# Altium schematic sheet 02-IC.SchDoc
size A
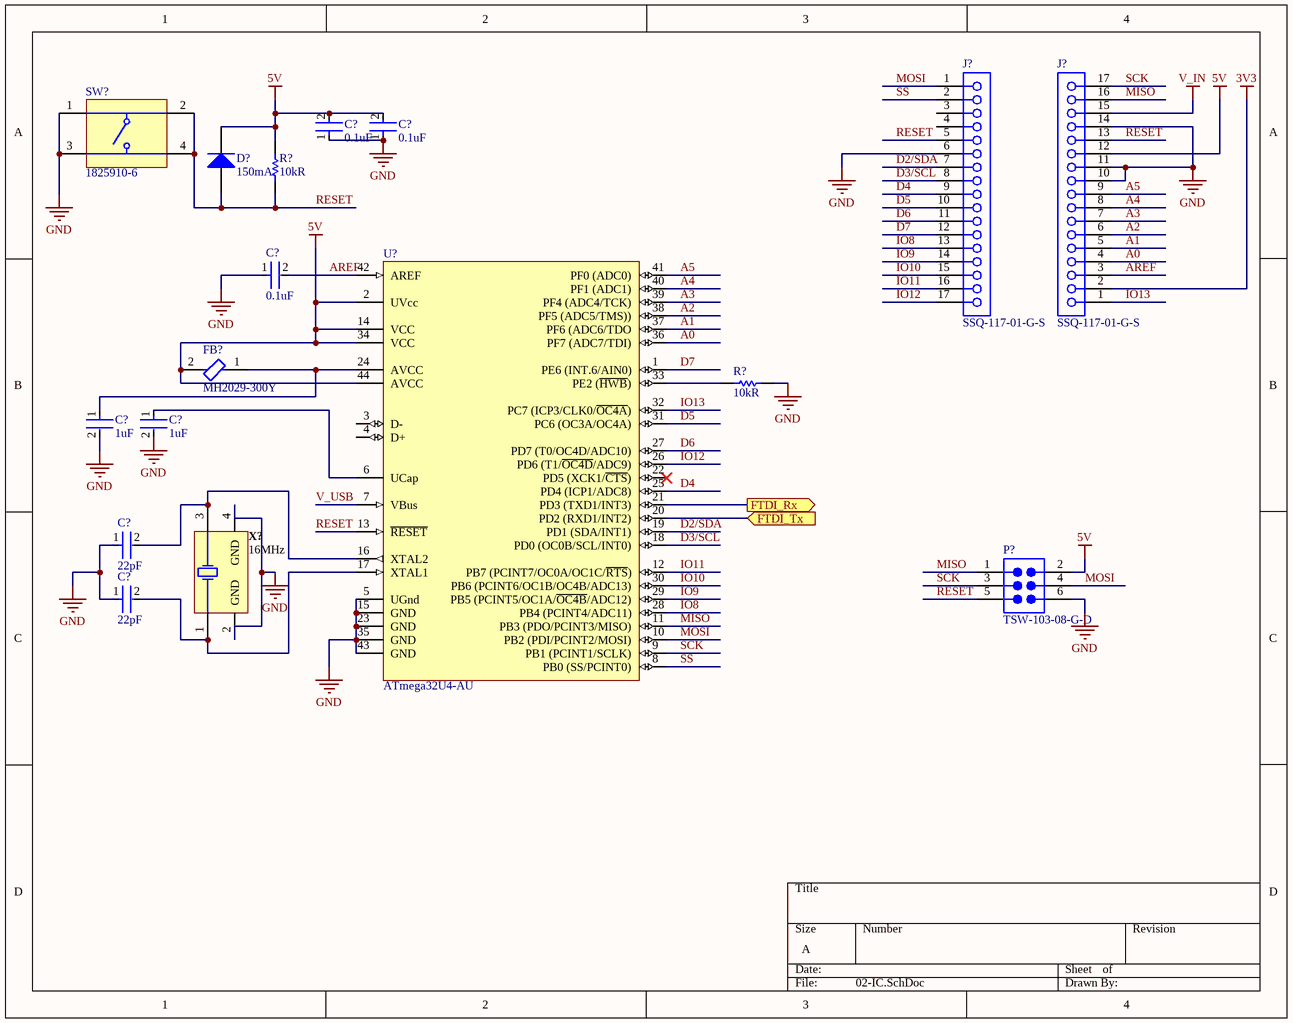
[diagram p0: 02-IC.SchDoc]

## Parts
(Parts that share a designator on the sheet are numbered #1, #2 ... from top to bottom, then left to right.)
C?#1  0.1uF  [FP-C1206C-EB-MFG]
C?#2  0.1uF  [FP-C1206C-EB-MFG]
C?#3  0.1uF  [FP-C1206C-EB-MFG]
C?#4  1uF  [FP-GRM15-0_1-MFG]
C?#5  1uF  [FP-GRM15-0_1-MFG]
C?#6  22pF  [FP-C0805C-DN-MFG]
C?#7  22pF  [FP-C0805C-DN-MFG]
D?  150mA  [BOUR-CD1206-S01575-2_L]
FB?  MH2029-300Y  [FP-MH2029-MFG]
J?#1  SSQ-117-01-G-S  [SMTC-SSQ-117-01-X-S]
J?#2  SSQ-117-01-G-S  [SMTC-SSQ-117-01-X-S]
P?  TSW-103-08-G-D  [SMTC-TSW-103-08-X-D]
R?#1  10kR  [RESC1609X50X30ML10T20]
R?#2  10kR  [RESC1609X50X30ML10T20]
SW?  1825910-6  [TECO-1825910-6_V]
U?  ATmega32U4-AU  [44ML_M]
X?  16MHz  [ABRA-ABM3B-4_V]

## Ports
FTDI_Rx (out), FTDI_Tx (in)

## Nets
3V3: J?#2.2
5V: C?#1.2 C?#2.2 D?.2(K) FB?.2 J?#2.12 P?.2 R?#1.2 U?.2(UVcc) U?.14(VCC) U?.34(VCC) U?.44(AVCC)
GND: C?#1.1 C?#2.1 C?#3.1 C?#4.2 C?#5.2 C?#6.1 C?#7.1 J?#1.6 J?#2.10 J?#2.11 J?#2.14 P?.6 R?#2.1 SW?.1 SW?.3 U?.5(UGnd) U?.15(GND) U?.23(GND) U?.35(GND) U?.43(GND) X?.2(GND) X?.4(GND)
V_IN: J?#2.15
A0: J?#2.4 U?.36(PF7_(ADC7/TDI))
A1: J?#2.5 U?.37(PF6_(ADC6/TDO)
A2: J?#2.6 U?.38(PF5_(ADC5/TMS)))
A3: J?#2.7 U?.39(PF4_(ADC4/TCK))
A4: J?#2.8 U?.40(PF1_(ADC1))
A5: J?#2.9 U?.41(PF0_(ADC0))
AREF: C?#3.2 J?#2.3 U?.42(AREF)
D2/SDA: J?#1.7 U?.19(PD1_(SDA/INT1))
D3/SCL: J?#1.8 U?.18(PD0_(OC0B/SCL/INT0))
D4: J?#1.9 U?.25(PD4_(ICP1/ADC8))
D5: J?#1.10 U?.31(PC6_(OC3A/OC4A))
D6: J?#1.11 U?.27(PD7_(T0/OC4D/ADC10))
D7: J?#1.12 U?.1(PE6_(INT.6/AIN0))
FTDI_Rx: U?.21(PD3_(TXD1/INT3)) ; port FTDI_Rx
FTDI_Tx: U?.20(PD2_(RXD1/INT2)) ; port FTDI_Tx
IO8: J?#1.13 U?.28(PB4_(PCINT4/ADC11))
IO9: J?#1.14 U?.29(PB5_(PCINT5/OC1A/~{OC4B}/ADC12))
IO10: J?#1.15 U?.30(PB6_(PCINT6/OC1B/OC4B/ADC13))
IO11: J?#1.16 U?.12(PB7_(PCINT7/OC0A/OC1C/~{RTS}))
IO12: J?#1.17 U?.26(PD6_(T1/~{OC4D}/ADC9))
IO13: J?#2.1 U?.32(PC7_(ICP3/CLK0/~{OC4A}))
MISO: J?#2.16 P?.1 U?.11(PB3_(PDO/PCINT3/MISO))
MOSI: J?#1.1 P?.4 U?.10(PB2_(PDI/PCINT2/MOSI))
RESET: D?.1(A) J?#1.5 J?#2.13 P?.5 R?#1.1 SW?.2 SW?.4 U?.13(~{RESET})
SCK: J?#2.17 P?.3 U?.9(PB1_(PCINT1/SCLK))
SS: J?#1.2 U?.8(PB0_(SS/PCINT0))
V_USB: U?.7(VBus)
NetC?#4_1: C?#4.1 FB?.1 U?.24(AVCC)
NetC?#5_1: C?#5.1 U?.6(UCap)
NetC?#6_2: C?#6.2 U?.16(XTAL2) X?.3(X2)
NetC?#7_2: C?#7.2 U?.17(XTAL1) X?.1(X1)
NetR?#2_2: R?#2.2 U?.33(PE2_(~{HWB}))

Not connected (* = marked no-connect by the designer): J?#1 3 4; U? 3(D-) 4(D+) 22(PD5_(XCK1/~{CTS}))*

## Library data of the parts
C?#1-C?#3 = CMP-03020-000153-1: CAP CER 0.1UF 100V X7R 1206; Manufacturer: KEMET; Manufacturer Part Number: C1206C104K1RACTU; Value: 0.10 μF; Tolerance: 0.1; Material: Ceramic; Temperature Coefficient: 15%; Automotive Grade: Grade 0; Voltage Rating: 100 V; Automotive: Yes; Ipc Land Pattern Name: CAPC320160X78; Device Class L1: Passive Components; ComponentLink2Description: Datasheet; Temperature Range Low: -55°C; Category: Cap; Octopart: https://octopart.com/c1206c104k1ractu-kemet-89521; Height: 0.88mm; Lead Free: Yes; Digikey Description: CAP CER 0.1UF 100V X7R 1206; Mouser Description: CAP CER 0.1UF 100V X7R 1206; Device Class L3: Ceramic Capacitors; Device Class L2: Capacitors; ComponentLink2URL: https://content.kemet.com/datasheets/KEM_C1007_X8R_ULTRA_150C_SMD.pdf; Temperature Range High: +150°C; Temperature Characteristic: X7R; RoHS: TRUE; Capacitance: 0.10 μF; Package: C1206C-EB; Temperature: -55°C to +150°C
C?#4 C?#5 = CMP-06035-000073-1: CAP CER 1UF 10V X5R 0402; Manufacturer Part Number: GRM155R61A105KE15D; Manufacturer: Murata; Material: Ceramic; Tolerance: 10%; Temperature Coefficient: 15%; Description: 1µF ±10% 10V Ceramic Capacitor X5R 0402 (1005 Metric); Octopart: https://octopart.com/grm155r61a105ke15d-murata-197442; Lead Free: Yes; ComponentLink2Description: Datasheet; Temperature: -55°C to +85°C; Temperature Range High: +85°C; Height: 0.55mm; Capacitance: 1uF; Ipc Land Pattern Name: CAPC10050X50; ComponentLink2URL: https://search.murata.co.jp/Ceramy/image/img/A01X/G101/ENG/GRM155R61A105KE15-01A.pdf; Temperature Range Low: -55°C; Device Class L2: Capacitors; Voltage Rating: 10V; RoHS: TRUE; Device Class L1: Passive Components; Device Class L3: Ceramic Capacitors; Temperature Characteristic: X5R; Mouser Description: 0402 1 uF 10 V ±10% Tolerance X5R Surface Mount Multilayer Ceramic Capacitor; Automotive: No; Package: GRM15-0.1; Digikey Description: CAP CER 1UF 10V X5R 0402; Value: 1uF; Category: Cap
C?#6 C?#7 = CMP-03020-014268-1: Capacitor; Ceramic; Cap; 22.0pF; Tol 5%; SMT; Vol-Rtg 50V; C0G; Tape and Reel; Manufacturer: KEMET; Manufacturer Part Number: C0805C220J5GACTU; Temperature Coefficient: 30ppm/°C; Description: C0805 22 pF C0G 30ppm/°C 5.00% 50 V; Tolerance: 0.05; Device Class L1: Passive Components; Mouser Description: Multilayer Ceramic Capacitors MLCC - SMD/SMT 50volts 22pF C0G 5%; Temperature Range Low: -55°C; Automotive: No; Voltage Rating: 50 V; Material: Ceramic; Category: Cap; Height: 0.88mm; Temperature Range High: +125°C; Capacitance: 22 pF; Digikey Description: Capacitor; Ceramic; Cap; 22.0pF; Tol 5%; SMT; Vol-Rtg 50V; C0G; Tape and Reel; Octopart: https://octopart.com/c0805c220j5gactu-kemet-145470; ComponentLink2Description: Datasheet; Device Class L2: Capacitors; Ipc Land Pattern Name: CAPC200125X78; Value: 22 pF; RoHS: TRUE; ComponentLink2URL: https://content.kemet.com/datasheets/KEM_C1003_C0G_SMD.pdf; Temperature: -55°C to +125°C; Device Class L3: Ceramic Capacitors; Lead Free: Yes; Temperature Characteristic: C0G; Package: C0805C-DN
D? = CMP-0583-00001-2: 75 V Small Signal Switching Diode, 150 mA, 2.5 uA, 1026 Molded Package, RoHS, Tape and Reel; Manufacturer: Bourns; PartNumber: CD1206-S01575; Reverse Voltage: 75 V; Reverse Current (Max.): 2.5 uA; Capacitance Between Terminals (Max.): 3 pF; Reverse Recovery Time (Max.): 4 nS; Forward Voltage (Max.): 1.00 V; Packing: Tape and Reel; Mounting Technology: Surface Mount; DatasheetVersion: Rev. 06/11; ComponentLink2URL: http://www.bourns.com/data/global/pdfs/CD1206_S01575.pdf; Average Forward Current: 150 mA; PackageReference: CD1206-S01575-2; RoHS: TRUE; ComponentLink1URL: http://www.bourns.com/; ComponentLink1Description: Manufacturer URL; ComponentLink3Description: Package Specification; ComponentLink3URL: http://www.bourns.com/data/global/pdfs/CD1206_S01575.pdf; ComponentLink2Description: Datasheet; PackageDescription: 2-Pin SMD, Body 3.2 x 1.5 mm
FB? = CMP-07252-000001-1: FERRITE BEAD 30 OHM 0805 1LN; Manufacturer: Bourns; Series Resistance: 25mΩ; Description: MH Series High Current Chip Ferrite Beads; Resistance: 30Ω; Value: 30Ω; Impedance At Frequency: 30Ω @ 100MHz; Rms Current: 3A; Tolerance: 25%; RoHS: TRUE; Manufacturer Part Number: MH2029-300Y; Temperature Range High: +125°C; Device Class L3: Ferrite Beads and Chips; Core Material: Ferrite; ComponentLink2Description: Datasheet; Category: FBead; Octopart: https://octopart.com/mh2029-300y-bourns-756929; Digikey Description: FERRITE BEAD 30 OHM 0805 1LN; Device Class L2: EMI / RFI Components; Lead Free: Yes; Mouser Description: Ferrite Beads 30 ohms 25% HIGH CURRENT; Automotive: No; Ipc Land Pattern Name: CAPC200120X90; Temperature: -55°C to +125°C; Device Class L1: Passive Components; Height: 1.1mm; ComponentLink2URL: https://www.bourns.com/docs/Product-Datasheets/mh.pdf; Package: MH2029; Temperature Range Low: -55°C
J?#1 J?#2 = CMP-1023-00316-1: SQ Post Socket, Through-hole, Vertical, -55 to 125 degC, 2.54 mm Pitch, 17-Pin, Female, RoHS; Manufacturer: Samtec; Pitch: 2.54 mm; ComponentLink1Description: Manufacturer URL; RoHS: True; PackageDescription: Assembly, Socket Strip .025[0.64] SQ Tail; ComponentLink1URL: http://www.samtec.com; DatasheetVersion: F-214; ComponentLink3URL: http://www.samtec.com/documents/webfiles/cpdf/SSQ-1XX-XX-XXX-X-XX-XXX-XX-X-MKT.pdf; Orientation: Vertical; PartNumber: SSQ-117-01-G-S; ComponentLink2URL: http://www.samtec.com/documents/webfiles/pdf/SSQ_TH.PDF; PackageReference: SSQ-117-01-X-S; ComponentLink2Description: Datasheet; Temperature Range: -55 to 125 degC; ComponentLink3Description: Package Specification; PackageVersion: BD, 6/1987; Mounting Technology: Through-hole
P? = CMP-1024-00338-1: 0.025" SQ Post Header, Through-hole, Vertical, -55 to 125 degC, 2.54 mm Pitch, 6-Pin, Male, RoHS; Manufacturer: Samtec; Pitch: 2.54 mm; ComponentLink1URL: http://www.samtec.com; ComponentLink2URL: http://www.samtec.com/documents/webfiles/pdf/TSW_TH.PDF; Temperature Range: -55 to 125 degC; RoHS: True; ComponentLink2Description: Datasheet; PackageReference: TSW-103-08-X-D; ComponentLink3Description: Package Specification; PackageDescription: .025[0.64] SQ. Post Terminal Strip Assembly; DatasheetVersion: F-214; Mounting Technology: Through-hole; ComponentLink1Description: Manufacturer URL; Orientation: Vertical; PartNumber: TSW-103-08-G-D; PackageVersion: DM, 8/1988; ComponentLink3URL: http://www.samtec.com/documents/webfiles/cpdf/TSW-XXX-XX-XXX-X-XX-XXX-MKT.pdf
R?#1 R?#2 = CMP-2000-03838-1: Manufacturer: Vishay Dale; Part Number: CRCW060310K0JNEA
SW? = CMP-1684-00021-1: Tact Switch, SPST-NO, 0.05 A, -35 to 85 degC, 4-Pin THD, RoHS, Bulk; Manufacturer: TE Connectivity; Maximum Contact Resistance: 100mOhm; Mechanical Life: 100000Cycles; Bushing Type: Unthreaded; Switch Configuration: OFF(ON); Maximum DC Voltage Rating: 24V; Contact Rating @ Voltage: 0.05A@24VDC; Actuator Color: Black; Body Orientation: Straight; Function: MomentaryContact; Illumination: N/R; Actuator Style: RoundButton; Actuator Material: PolybutyleneTerephthalate; Dielectric Strength: 500VAC; Pole Throw Configuration: SPST; Actuator Length: 1.4mm; Product Weight: N/A; Contact Material: CopperAlloy; Housing Material: N/A; Terminal Type: PCPins; Minimum Insulation Resistance: 100MOhm; Package Description: 4-Pin Through Hole Device, Body 5.99 x 5.99 mm, Pitch 6.5 mm; Part No: 1825910-6; Package Reference: THD; Base Material: N/A; Manufacturer URL: http://www.te.com; Contact Plating: Silver; RoHS: Yes; Datasheet Version: Rev. C9; Electrical Life: 100000Cycles; Maximum AC Voltage Rating: N/A; Thread Size: N/R; Operating Temperature: -35to85C; Mounting: ThroughHole; Dimension: 5.99x5mm; Datasheet URL: http://www.te.com/commerce/DocumentDelivery/DDEController?Action=showdoc&DocId=Customer+Drawing%7F1825910%7FC9%7Fpdf%7FEnglish%7FENG_CD_1825910_C9.pdf%7F1825910-6; Family: 1825910; Seal Location: N/A; Seal Description: N/A; Packaging: N/A
U? = CMP-0095-00285-2: 8-bit AVR Microcontroller, 2.7-5.5V, 16MHz, 32KB Flash, 1KB EEPROM, 2.5KB SRAM, USB Controller, 44-pin TQFP, Industrial Grade (-40°C to 85°C), Ext Osc; RevisionNote: DatasheetVersion updated. URLs added.; ComponentLink1Description: Manufacturer URL; PackageDescription: 44-Pin Plastic Thin Quad Flat Pack, 10 x 10 x 1.0 mm Body, 0.8 mm Pitch (TQFP); DatasheetVersion: revF, Nov-2010; ComponentLink2URL: http://www.atmel.com/dyn/resources/prod_documents/doc7766.pdf; ComponentLink1URL: http://www.atmel.com/; PackageReference: 44ML; ComponentLink2Description: ATmega16U4/32U4 Datasheet; PackageVersion: rev.G, Jul-2007; ComponentLink3URL: http://www.atmel.com/dyn/resources/prod_documents/7766S.pdf; ComponentLink3Description: ATmega16U4 ATmega32U4 Summary
X? = CMP-1688-00003-1: Ceramic SMD Crystal, 16 MHz, +/- 20 ppm, 50 Ohm, -20 to 70 degC, 4-Pin SMD, RoHS, Tape and Reel; Current Rating: 1.82 A; Resistance: 0.033 Ohm; Tolerance: 30%; Shielding: Shielded; REACH SVHC: Unknown; RoHSCompliant: True; PackageReference: ABM3B; Mount: Surface Mount; Max Operating Temperature: 105degC; DatasheetVersion: Aug-15; Package Quantity: 500; PackageDescription: 4-Pin Surface Mount Device, Body 5 x 3.2 mm; ComponentLink2URL: http://www.abracon.com/Resonators/abm3b.pdf; Packaging: Tape and Reel; Height: 2.8 mm; ComponentLink1URL: http://www.abracon.com/; ComponentLink2Description: Datasheet; Length: 0.197 inch; ComponentLink1Description: Manufacturer URL; Case/Package: 5028; Width: 0.197 inch; Min Operating Temperature: -40degC